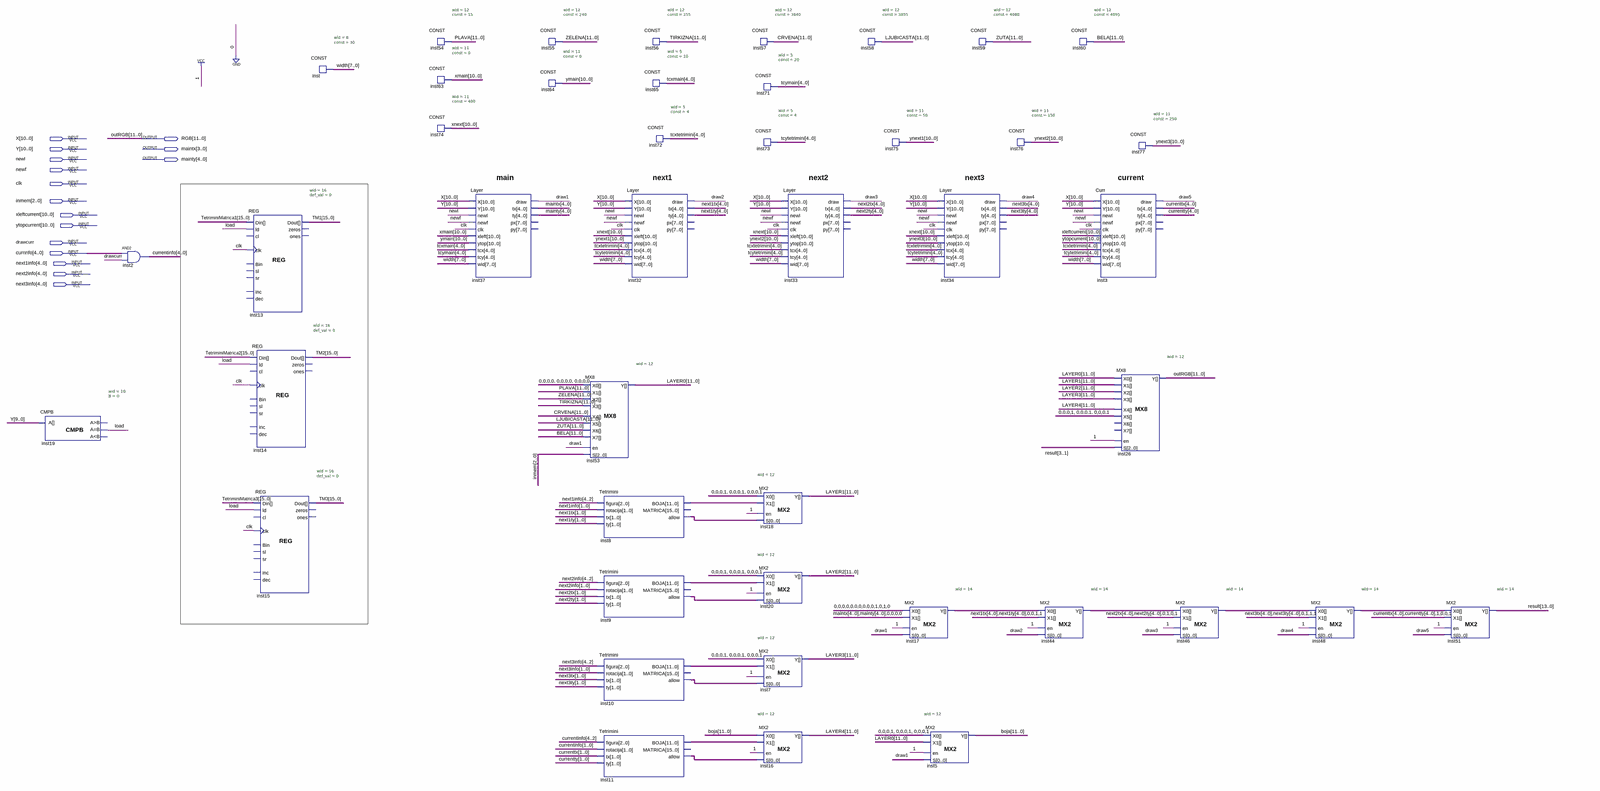
[diagram p0: schematic sheet, whole]
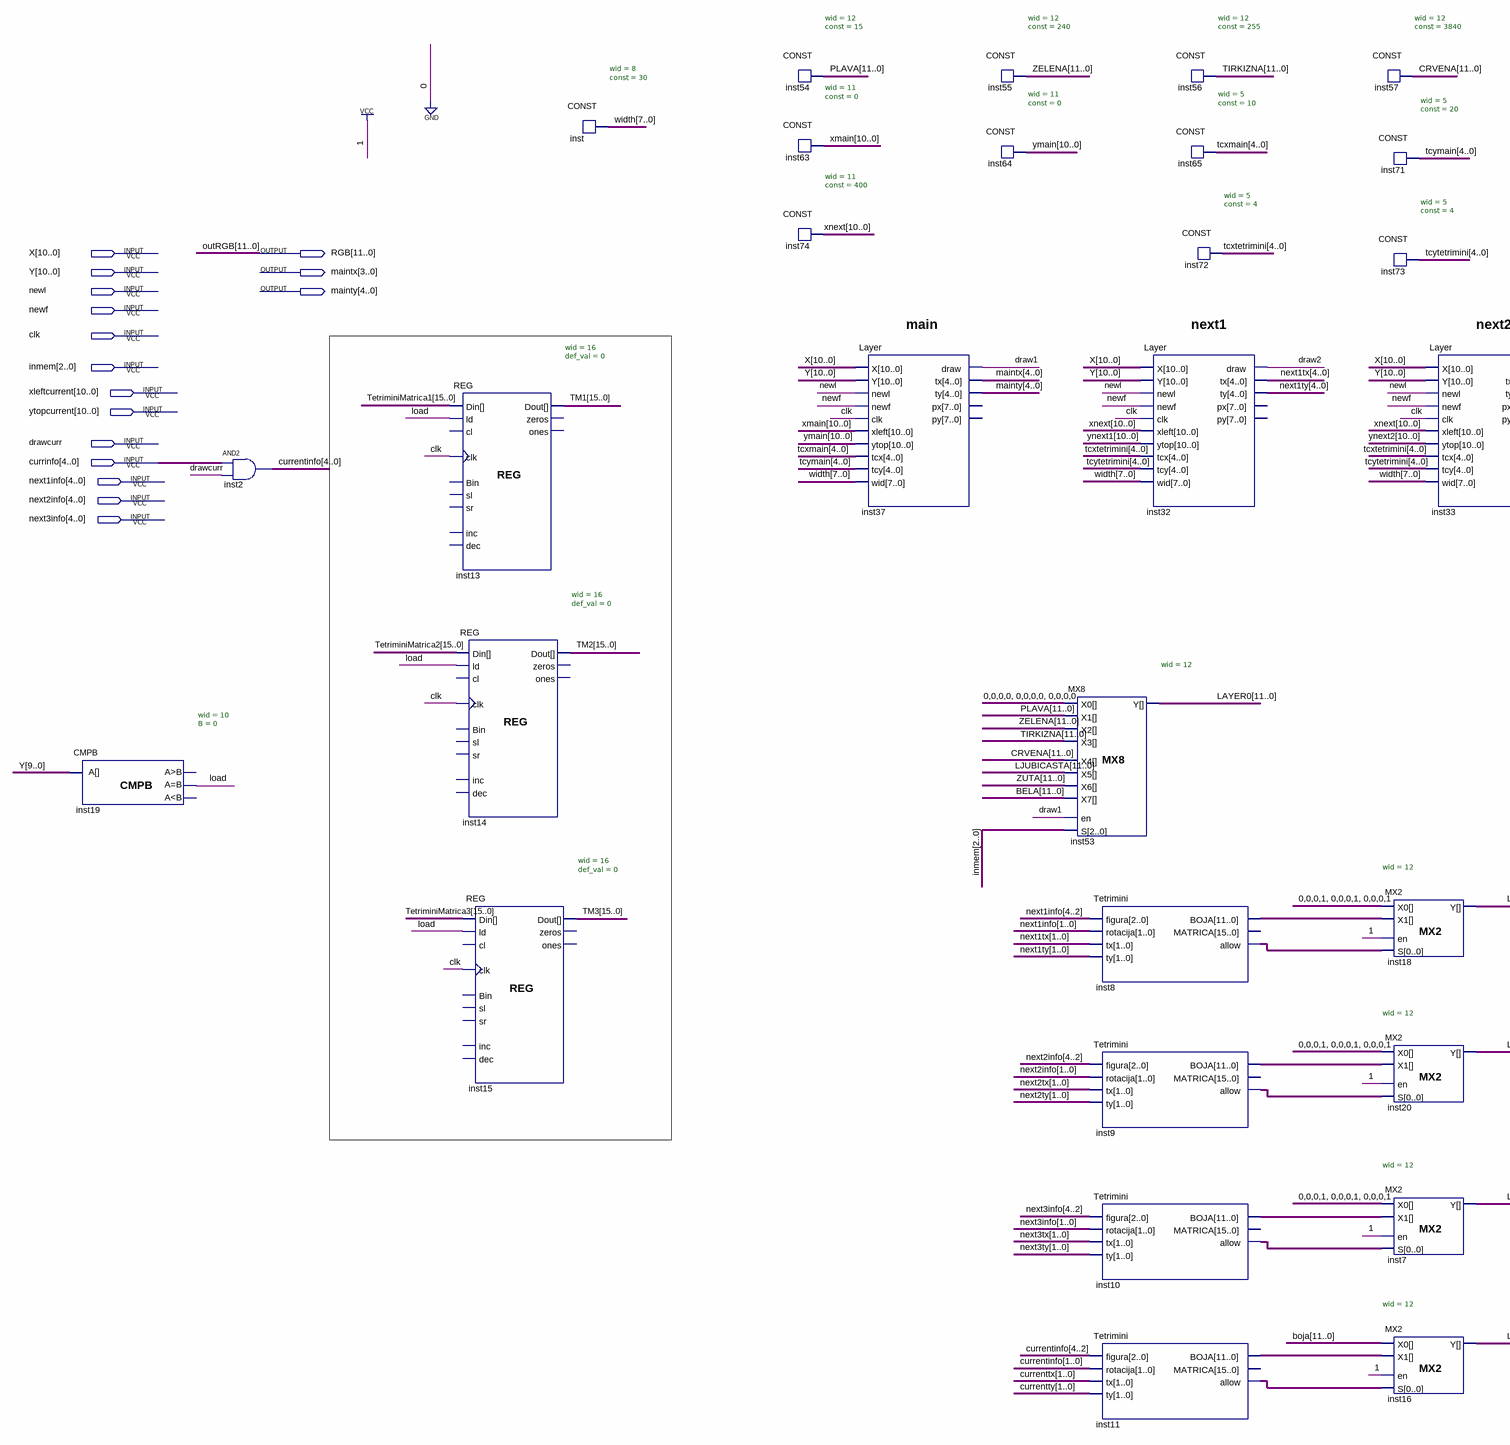
[diagram p1: schematic sheet, left part]
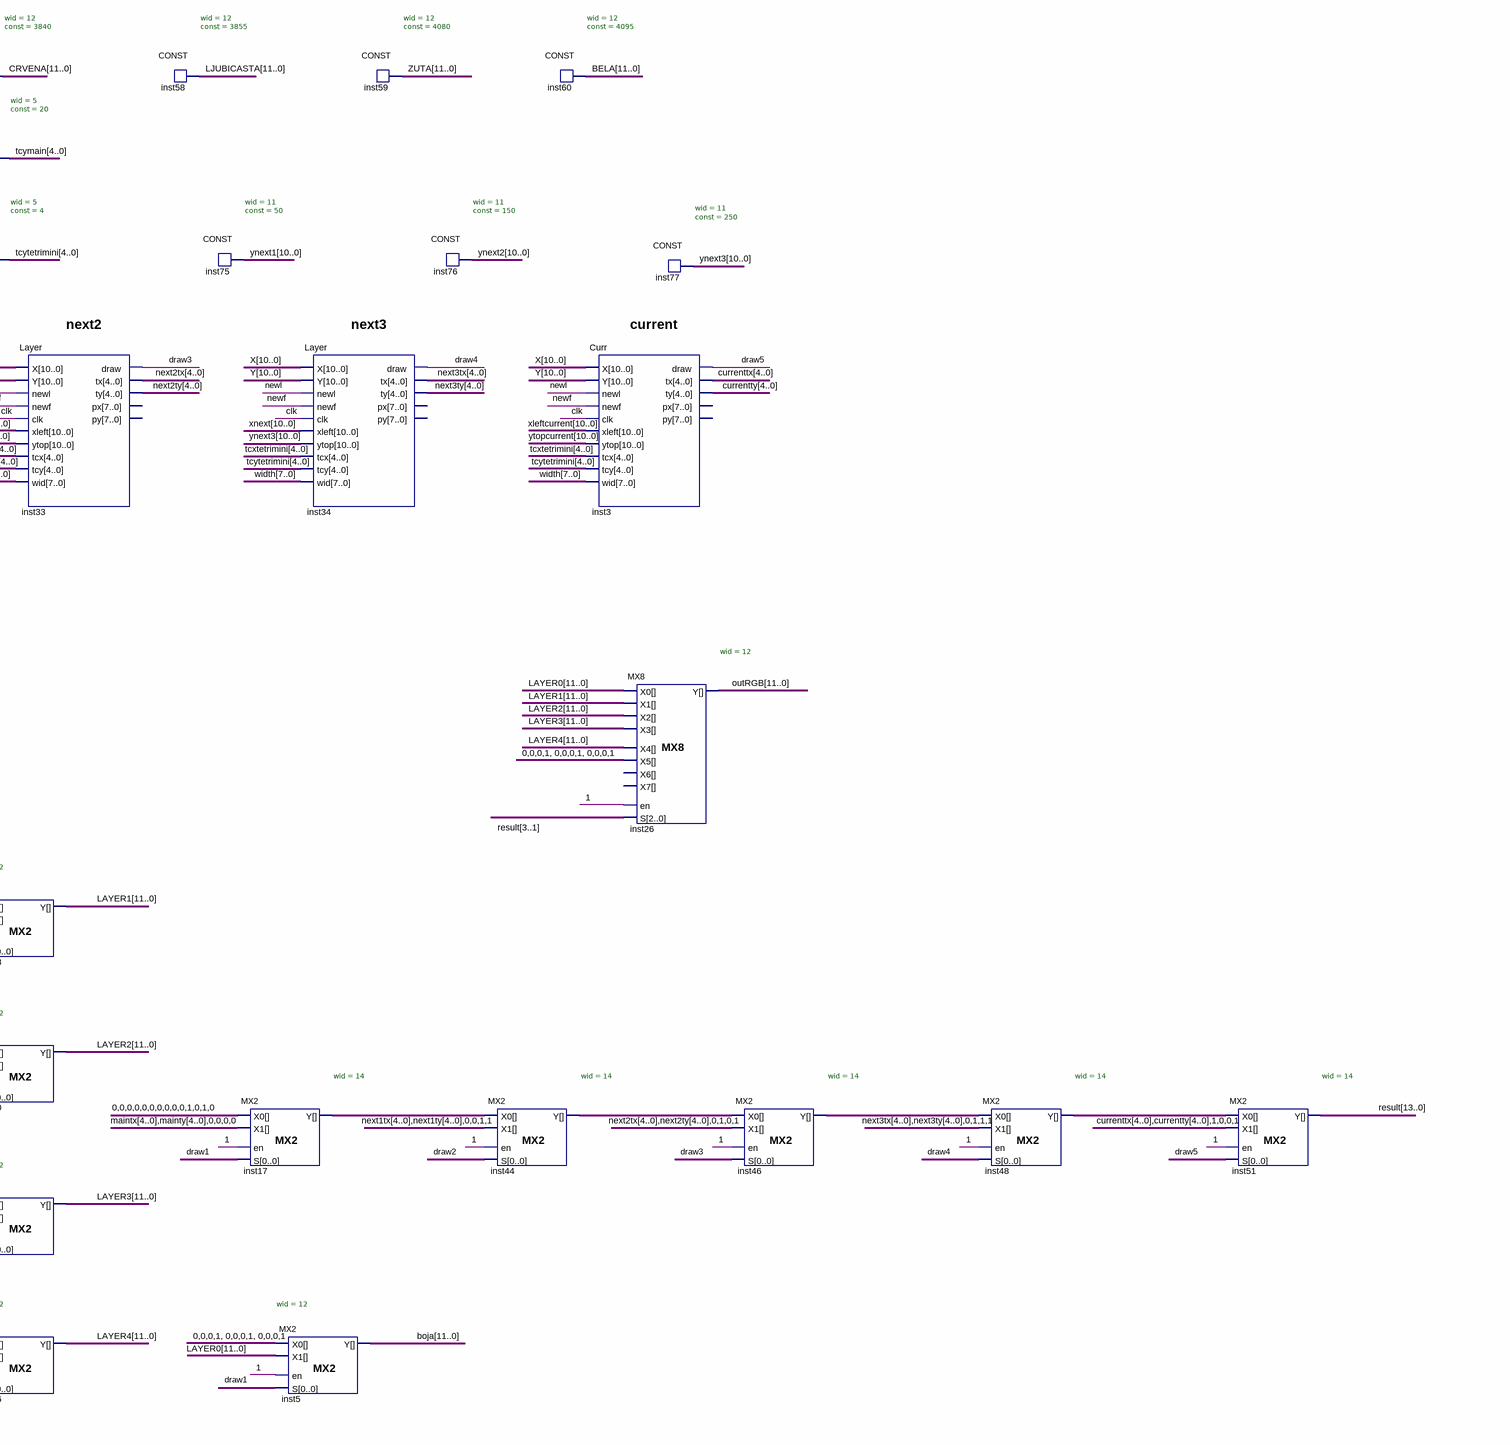
[diagram p2: schematic sheet, right part]
// Quartus schematic Crtanje.bdf as structural Verilog: 44 symbols, 16 pins
module Crtanje (
  input  [10:0] X,
  input  [10:0] Y,
  input  newl,
  input  newf,
  input  clk,
  input  [2:0] inmem,
  input  [10:0] xleftcurrent,
  input  [10:0] ytopcurrent,
  input  drawcurr,
  input  [4:0] currinfo,
  input  [4:0] next1info,
  input  [4:0] next2info,
  input  [4:0] next3info,
  output [11:0] RGB,
  output [4:0] maintx,
  output [4:0] mainty
);

  wire draw1, draw2, draw3, draw4, draw5, inst8_allow, inst9_allow, inst10_allow, inst11_allow, load;
  wire [4:0] currentinfo, currenttx, currentty, next1tx, next1ty, next2tx, next2ty, next3tx, next3ty,
       tcxmain, tcxtetrimini, tcymain, tcytetrimini;
  wire [7:0] width;
  wire [10:0] xmain, xnext, ymain, ynext1, ynext2, ynext3;
  wire [11:0] BELA, boja, CRVENA, inst8_boja, inst9_boja, inst10_boja, inst11_boja, LAYER0, LAYER1, LAYER2,
       LAYER3, LAYER4, LJUBICASTA, PLAVA, TIRKIZNA, ZELENA, ZUTA;
  wire [13:0] inst17_y, inst44_y, inst46_y, inst48_y, result;
  wire [15:0] TetriminiMatrica1, TetriminiMatrica2, TetriminiMatrica3, TM1, TM2, TM3;

  CMPB #(.wid(10), .B(0)) inst19 (.A(Y[9:0]), .eq(load));  // open: gr, ls
  assign currentinfo = currinfo & {5{drawcurr}};  // AND2 inst2, 5 bits wide
  REG #(.wid(16), .def_val(0)) inst13 (
    .ld(load), .clk(clk), .Din(TetriminiMatrica1), .Dout(TM1));  // open: cl, Bin, sl, sr, inc, dec, zeros, ones
  REG #(.wid(16), .def_val(0)) inst14 (
    .ld(load), .clk(clk), .Din(TetriminiMatrica2), .Dout(TM2));  // open: cl, Bin, sl, sr, inc, dec, zeros, ones
  REG #(.wid(16), .def_val(0)) inst15 (
    .ld(load), .clk(clk), .Din(TetriminiMatrica3), .Dout(TM3));  // open: cl, Bin, sl, sr, inc, dec, zeros, ones
  CONST #(.wid(8), .\const (30)) inst (.data(width));
  CONST #(.wid(12), .\const (15)) inst54 (.data(PLAVA));
  CONST #(.wid(11), .\const (0)) inst63 (.data(xmain));
  CONST #(.wid(11), .\const (400)) inst74 (.data(xnext));
  Layer inst37 (
    .X(X), .Y(Y), .newl(newl), .newf(newf), .clk(clk), .xleft(xmain), .ytop(ymain), .tcx(tcxmain),
    .tcy(tcymain), .wid(width), .draw(draw1), .tx(maintx), .ty(mainty));  // open: px, py
  CONST #(.wid(12), .\const (240)) inst55 (.data(ZELENA));
  CONST #(.wid(11), .\const (0)) inst64 (.data(ymain));
  MX8 #(.wid(12)) inst53 (
    .X0({12{1'b0}}), .X1(PLAVA), .X2(ZELENA), .X3(TIRKIZNA), .X4(CRVENA), .X5(LJUBICASTA), .X6(ZUTA),
    .X7(BELA), .en(draw1), .S(inmem), .Y(LAYER0));
  Tetrimini inst8 (
    .figura(next1info[4:2]), .rotacija(next1info[1:0]), .tx(next1tx[1:0]), .ty(next1ty[1:0]),
    .BOJA(inst8_boja), .allow(inst8_allow));  // open: MATRICA
  Tetrimini inst9 (
    .figura(next2info[4:2]), .rotacija(next2info[1:0]), .tx(next2tx[1:0]), .ty(next2ty[1:0]),
    .BOJA(inst9_boja), .allow(inst9_allow));  // open: MATRICA
  Tetrimini inst10 (
    .figura(next3info[4:2]), .rotacija(next3info[1:0]), .tx(next3tx[1:0]), .ty(next3ty[1:0]),
    .BOJA(inst10_boja), .allow(inst10_allow));  // open: MATRICA
  Tetrimini inst11 (
    .figura(currentinfo[4:2]), .rotacija(currentinfo[1:0]), .tx(currenttx[1:0]), .ty(currentty[1:0]),
    .BOJA(inst11_boja), .allow(inst11_allow));  // open: MATRICA
  CONST #(.wid(12), .\const (255)) inst56 (.data(TIRKIZNA));
  CONST #(.wid(5), .\const (10)) inst65 (.data(tcxmain));
  CONST #(.wid(5), .\const (4)) inst72 (.data(tcxtetrimini));
  Layer inst32 (
    .X(X), .Y(Y), .newl(newl), .newf(newf), .clk(clk), .xleft(xnext), .ytop(ynext1), .tcx(tcxtetrimini),
    .tcy(tcytetrimini), .wid(width), .draw(draw2), .tx(next1tx), .ty(next1ty));  // open: px, py
  CONST #(.wid(12), .\const (3840)) inst57 (.data(CRVENA));
  CONST #(.wid(5), .\const (20)) inst71 (.data(tcymain));
  CONST #(.wid(5), .\const (4)) inst73 (.data(tcytetrimini));
  MX2 #(.wid(12)) inst18 (.X0(12'b000100010001), .X1(inst8_boja), .en(1'b1), .S(inst8_allow), .Y(LAYER1));
  MX2 #(.wid(12)) inst20 (.X0(12'b000100010001), .X1(inst9_boja), .en(1'b1), .S(inst9_allow), .Y(LAYER2));
  MX2 #(.wid(12)) inst7 (.X0(12'b000100010001), .X1(inst10_boja), .en(1'b1), .S(inst10_allow), .Y(LAYER3));
  MX2 #(.wid(12)) inst16 (.X0(boja), .X1(inst11_boja), .en(1'b1), .S(inst11_allow), .Y(LAYER4));
  Layer inst33 (
    .X(X), .Y(Y), .newl(newl), .newf(newf), .clk(clk), .xleft(xnext), .ytop(ynext2), .tcx(tcxtetrimini),
    .tcy(tcytetrimini), .wid(width), .draw(draw3), .tx(next2tx), .ty(next2ty));  // open: px, py
  CONST #(.wid(12), .\const (3855)) inst58 (.data(LJUBICASTA));
  CONST #(.wid(11), .\const (50)) inst75 (.data(ynext1));
  MX2 #(.wid(14)) inst17 (.X0(14'b00000000001010), .X1({maintx, mainty, 4'b0000}), .en(1'b1), .S(draw1), .Y(inst17_y));
  MX2 #(.wid(12)) inst5 (.X0(12'b000100010001), .X1(LAYER0), .en(1'b1), .S(draw1), .Y(boja));
  Layer inst34 (
    .X(X), .Y(Y), .newl(newl), .newf(newf), .clk(clk), .xleft(xnext), .ytop(ynext3), .tcx(tcxtetrimini),
    .tcy(tcytetrimini), .wid(width), .draw(draw4), .tx(next3tx), .ty(next3ty));  // open: px, py
  CONST #(.wid(12), .\const (4080)) inst59 (.data(ZUTA));
  CONST #(.wid(11), .\const (150)) inst76 (.data(ynext2));
  MX2 #(.wid(14)) inst44 (.X0(inst17_y), .X1({next1tx, next1ty, 4'b0011}), .en(1'b1), .S(draw2), .Y(inst44_y));
  CONST #(.wid(12), .\const (4095)) inst60 (.data(BELA));
  Curr inst3 (
    .X(X), .Y(Y), .newl(newl), .newf(newf), .clk(clk), .xleft(xleftcurrent), .ytop(ytopcurrent),
    .tcx(tcxtetrimini), .tcy(tcytetrimini), .wid(width), .draw(draw5), .tx(currenttx), .ty(currentty));  // open: px, py
  MX8 #(.wid(12)) inst26 (
    .X0(LAYER0), .X1(LAYER1), .X2(LAYER2), .X3(LAYER3), .X4(LAYER4), .X5(12'b000100010001), .en(1'b1),
    .S(result[3:1]), .Y(RGB));  // open: X6, X7
  CONST #(.wid(11), .\const (250)) inst77 (.data(ynext3));
  MX2 #(.wid(14)) inst46 (.X0(inst44_y), .X1({next2tx, next2ty, 4'b0101}), .en(1'b1), .S(draw3), .Y(inst46_y));
  MX2 #(.wid(14)) inst48 (.X0(inst46_y), .X1({next3tx, next3ty, 4'b0111}), .en(1'b1), .S(draw4), .Y(inst48_y));
  MX2 #(.wid(14)) inst51 (.X0(inst48_y), .X1({currenttx, currentty, 4'b1001}), .en(1'b1), .S(draw5), .Y(result));

  // Other names for the same wires on the sheet: outRGB[11:0] = RGB

  // Notes on the sheet:
  //   main
  //   next1
  //   next2
  //   next3
  //   current
endmodule
